# Altium schematic sheet SRAM.SchDoc: SRAM0
size A; Revision: 04
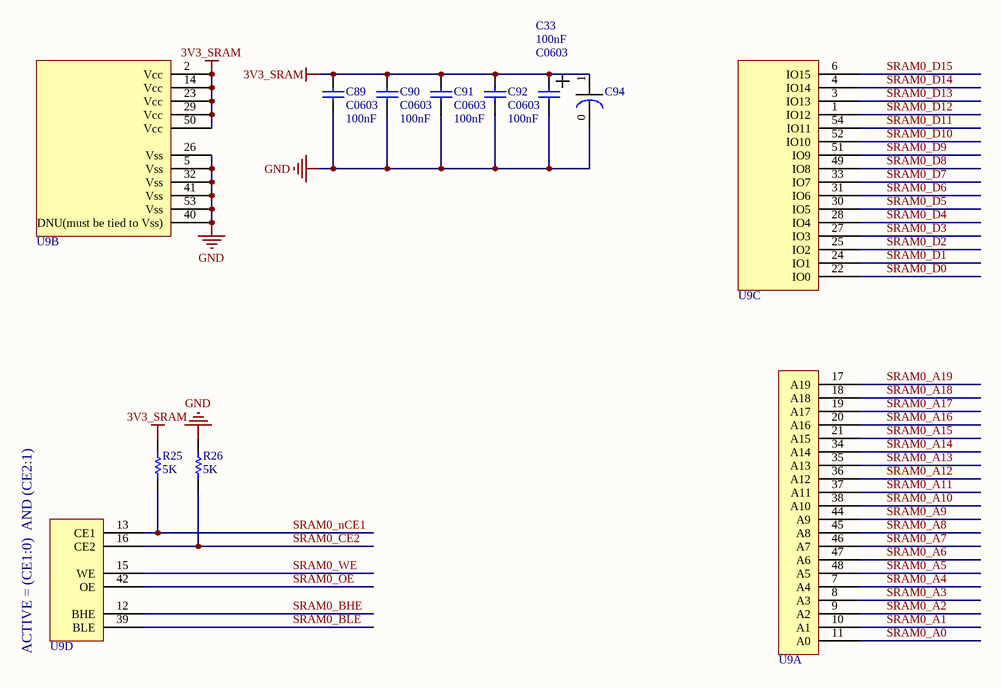
[diagram p0: SRAM.SchDoc]

## Parts
C33  C0603  value 100nF  [0603]
C89  C0603  value 100nF  [0603]
C90  C0603  value 100nF  [0603]
C91  C0603  value 100nF  [0603]
C92  C0603  value 100nF  [0603]
C94  Electrolytic SMD Cap  [22_47u_10A]  (value not drawn)
R25  5K  [ERA-0805]
R26  5K  [ERA-0805]
U9  SRAM  [PCBComponent_1]  (value not drawn)  (parts A,B,C,D of 4)

## Nets
3V3_SRAM: C33.2 C89.2 C90.2 C91.2 C92.2 C94.1 R25.2 U9.2(Vcc) U9.14(Vcc) U9.23(Vcc) U9.29(Vcc) U9.50(Vcc)
GND: C33.1 C89.1 C90.1 C91.1 C92.1 C94.0 R26.2 U9.5(Vss) U9.26(Vss) U9.32(Vss) U9.40(DNU(must_be_tied_to_Vss)) U9.41(Vss) U9.53(Vss)
SRAM0_A0: U9.11(A0)
SRAM0_A1: U9.10(A1)
SRAM0_A2: U9.9(A2)
SRAM0_A3: U9.8(A3)
SRAM0_A4: U9.7(A4)
SRAM0_A5: U9.48(A5)
SRAM0_A6: U9.47(A6)
SRAM0_A7: U9.46(A7)
SRAM0_A8: U9.45(A8)
SRAM0_A9: U9.44(A9)
SRAM0_A10: U9.38(A10)
SRAM0_A11: U9.37(A11)
SRAM0_A12: U9.36(A12)
SRAM0_A13: U9.35(A13)
SRAM0_A14: U9.34(A14)
SRAM0_A15: U9.21(A15)
SRAM0_A16: U9.20(A16)
SRAM0_A17: U9.19(A17)
SRAM0_A18: U9.18(A18)
SRAM0_A19: U9.17(A19)
SRAM0_BHE: U9.12(BHE)
SRAM0_BLE: U9.39(BLE)
SRAM0_CE2: R26.1 U9.16(CE2)
SRAM0_D0: U9.22(IO0)
SRAM0_D1: U9.24(IO1)
SRAM0_D2: U9.25(IO2)
SRAM0_D3: U9.27(IO3)
SRAM0_D4: U9.28(IO4)
SRAM0_D5: U9.30(IO5)
SRAM0_D6: U9.31(IO6)
SRAM0_D7: U9.33(IO7)
SRAM0_D8: U9.49(IO8)
SRAM0_D9: U9.51(IO9)
SRAM0_D10: U9.52(IO10)
SRAM0_D11: U9.54(IO11)
SRAM0_D12: U9.1(IO12)
SRAM0_D13: U9.3(IO13)
SRAM0_D14: U9.4(IO14)
SRAM0_D15: U9.6(IO15)
SRAM0_nCE1: R25.1 U9.13(CE1)
SRAM0_OE: U9.42(OE)
SRAM0_WE: U9.15(WE)

## Notes on the sheet
- ACTIVE = (CE1:0)  AND (CE2:1)
- Engineer:
- Title:
- Saleh Jamali
- Revision:

## Library data of the parts
C33 C89-C92 = C0603: Ceramic Chip Capacitor - Standard; Note: Footprint corresponds to dimensions for bulk cassette packaging. This case size has tightened tolerances.; Published: 17-Jul-2002; LatestRevisionDate: 19-Mar-2004; LatestRevisionNote: Silkscreen size reduced.; DatasheetDocument: Mar-2001; PackageDocument: Mar-2001; PackageReference: 0603; Publisher: Altium Limited; Code_JEITA: 0603; Code_IPC: 1608 [0603]; ComponentLink1Description: Manufacturer Link; ComponentLink1URL: http://www.kemet.com/; ComponentLink2Description: Datasheet; ComponentLink2URL: http://www.kemet.com/kemet/web/homepage/kechome.nsf/vapubfilesname/F3102TA.pdf/$file/F3102TA.pdf
R25 R26 = ERA6Y: Rectangular Thick Film Chip Resistor, 10 Ohm to 1M Ohm Range, 0.1% and 0.5% Tolerance, 0805 Size, 0.1 W; Note: If flow soldering, adjust pad width of PCB Footprint to 0.7 - 0.8 times the width of the resistor.; Published: 17-Dec-2003; LatestRevisionDate: 19-Mar-2004; LatestRevisionNote: Silkscreen size reduced.; PackageDocument: Mar-2003; PackageReference: ERA-0805; Publisher: Altium Limited; Code_IPC: 2012 [0805]; ComponentLink1Description: Manufacturer Link; ComponentLink1URL: http://www.panasonic.com/industrial/components/resistive_products.htm; ComponentLink2Description: Datasheet; ComponentLink2URL: http://www.panasonic.com/industrial/components/pdf/AOA0000CE8.pdf
U9 = CY7C1061AV33: Static RAM
C94 = Electrolytic SMD Cap: supplier: eshop.eca.ir